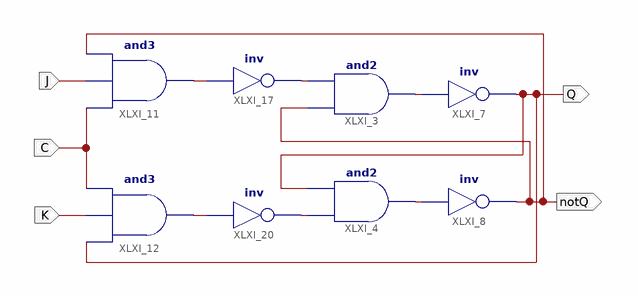
[diagram p0: schematic sheet 1]
// Xilinx ISE schematic scheme_pt1.sch (virtex5) as structural Verilog: 8 symbols, 5 ports
module scheme_pt1 (
  input  C,
  input  J,
  input  K,
  output notQ,
  output Q
);

  wire XLXN_18, XLXN_19, XLXN_63, XLXN_64, XLXN_73, XLXN_74;

  and XLXI_3 (XLXN_18, notQ, XLXN_64);
  and XLXI_4 (XLXN_19, XLXN_74, Q);
  not XLXI_7 (Q, XLXN_18);
  not XLXI_8 (notQ, XLXN_19);
  not XLXI_17 (XLXN_64, XLXN_63);
  not XLXI_20 (XLXN_74, XLXN_73);
  and XLXI_12 (XLXN_73, Q, K, C);
  and XLXI_11 (XLXN_63, C, J, notQ);
endmodule
